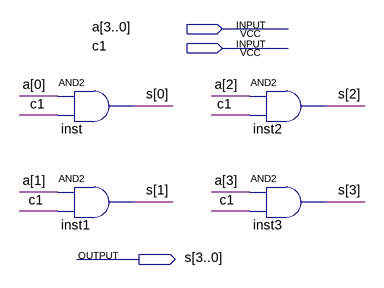
[diagram p0: schematic sheet]
// Quartus schematic and2_4bits.bdf as structural Verilog: 4 symbols, 3 pins
module and2_4bits (
  input  [3:0] a,
  input  c1,
  output [3:0] s
);

  and inst (s[0], a[0], c1);
  and inst1 (s[1], a[1], c1);
  and inst2 (s[2], a[2], c1);
  and inst3 (s[3], a[3], c1);
endmodule
